# Altium schematic sheet integrator_inverter.SchDoc: Active Integrator
size A; Engineer: A. Peck; Organization: UCLA High Energy Physics; DocumentNumber: 13; Revision: 3.0; SheetNumber: 13; SheetTotal: 15; Project: LCT Comparator Tester
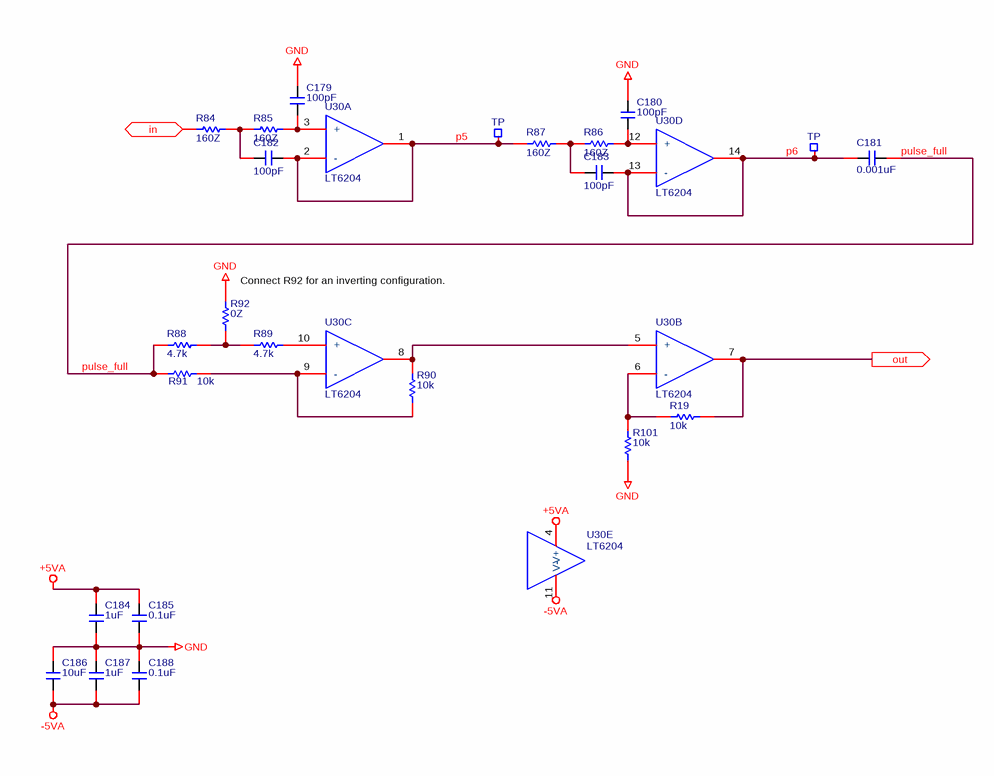
[diagram p0: integrator_inverter.SchDoc]

## Parts
C179  100pF  [C0603]
C180  100pF  [C0603]
C181  0.001uF  [C0603]
C182  100pF  [C0603]
C183  100pF  [C0603]
C184  1uF  [C0603]
C185  0.1uF  [C0603]
C186  10uF  [c1206]
C187  1uF  [C0603]
C188  0.1uF  [C0603]
R19  10k  [R0603]
R84  160Z  [R0603]
R85  160Z  [R0603]
R86  160Z  [R0603]
R87  160Z  [R0603]
R88  4.7k  [R0603]
R89  4.7k  [R0603]
R90  10k  [R0603]
R91  10k  [R0603]
R92  0Z  [R0603]
R101  10k  [R0603]
TP36  TP  [TP_MICRO]  (no BOM)
TP37  TP  [TP_MICRO]  (no BOM)
U30  LT6204  [SOIC-14]  (parts A,B,C,D,E of 5)

## Ports
in (in), out (out)

## Nets
+5VA: C184.2 C185.2 U30.4(V+)
-5VA: C186.1 C187.1 C188.1 U30.11(V-)
GND: C179.2 C180.2 C184.1 C185.1 C186.2 C187.2 C188.2 R92.1 R101.2
in: R84.1 ; port in
out: R19.2 U30.7(OUT) ; port out
p5: C182.2 R87.1 TP36.1 U30.1(OUT) U30.2(-)
p6: C181.2 C183.2 TP37.1 U30.13(-) U30.14(OUT)
pulse_full: C181.1 R88.1 R91.1
NetC179_1: C179.1 R85.2 U30.3(+)
NetC180_1: C180.1 R86.2 U30.12(+)
NetC182_1: C182.1 R84.2 R85.1
NetC183_1: C183.1 R86.1 R87.2
NetR19_1: R19.1 R101.1 U30.6(-)
NetR88_2: R88.2 R89.1 R92.2
NetR89_2: R89.2 U30.10(+)
NetR90_1: R90.1 U30.5(+) U30.8(OUT)
NetR90_2: R90.2 R91.2 U30.9(-)

## Notes on the sheet
- (near R92) Connect R92 for an inverting configuration.
- Date:
- Rev:
- of
- Sheet

## Library data of the parts
C179 C180 C182 C183 = AVX/06035A101KAT2A: CAP-CER, 0, 100pF, 10%, 50V, 0603; Manufacturer: AVX Corporation; Temperature Coefficient: C0G, NP0; Supplier 1: Digi-Key; Supplier Part Number 1: 478-3717-1-ND; Manufacturer Part Number: 06035A101KAT2A; RoHS: RoHS Compliant; Category: Capacitors; Stock 1: 55355; Pricing 1: 1=0.16, 10=0.117, 25=0.0856, 50=0.0664, 100=0.0551, 250=0.04556, 500=0.03862, 1000=0.03197 (USD); Packaging: Cut Tape (CT); Part Status: Active; Capacitance: 100pF; Tolerance: ±10%; Voltage - Rated: 50V; Operating Temperature: -55°C ~ 125°C; Features: -; Ratings: -; Applications: General Purpose; Failure Rate: *; Mounting Type: Surface Mount, MLCC; Package / Case: 0603 (1608 Metric); Size / Dimension: 0.063" L x 0.032" W (1.60mm x 0.81mm); Height - Seated (Max): -; Thickness (Max): 0.035" (0.90mm); Lead Spacing: -; Lead Style: -; ComponentLink1URL: http://catalogs.avx.com/SurfaceMount.pdf; ComponentLink1Description: http://catalogs.avx.com/SurfaceMount.pdf
C181 = CAP/GRM188R71H102KA01D: CAP-CER, 0, 1000pF, 10%, 50V, 0603; Manufacturer: Murata Electronics North America; Temperature Coefficient: X7R; Supplier 1: Digi-Key; Supplier Part Number 1: 490-1494-6-ND; Manufacturer Part Number: GRM188R71H102KA01D; RoHS: RoHS Compliant; Category: Capacitors; Stock 1: 1044569; Pricing 1: 1=0.1, 10=0.02, 50=0.0108, 100=0.0091, 250=0.00744, 500=0.00636, 1000=0.00495 (USD); Packaging: Digi-Reel®; Capacitance: 1000pF; Tolerance: ±10%; Voltage - Rated: 50V; Mounting Type: Surface Mount, MLCC; Operating Temperature: -55°C ~ 125°C; Applications: General Purpose; Ratings: -; Package / Case: 0603 (1608 Metric); Size / Dimension: 0.063" L x 0.031" W (1.60mm x 0.80mm); Height - Seated (Max): -; Thickness (Max): 0.035" (0.90mm); Lead Spacing: -; Features: -; Lead Style: -; ComponentLink1URL: http://www.murata.com/~/media/webrenewal/support/library/catalog/products/capacitor/mlcc/c02e.pdf; ComponentLink1Description: http://www.murata.com/~/media/webrenewal/support/library/catalog/products/capacitor/mlcc/c02e.pdf; Supplier 2: Newark; Supplier Part Number 2: 51B220
C184 C187 = Murata/GRM188R61E105KA12D: CAP-CER, 2, 1.0uF, 10%, 25V, 0603; Manufacturer: Murata Electronics North America; Capacitance: 1µF; Temperature Coefficient: X5R; Supplier 1: Digi-Key; Supplier Part Number 1: 490-3897-1-ND; Manufacturer Part Number: GRM188R61E105KA12D; RoHS: RoHS Compliant; Category: Capacitors; Stock 1: 1899119; Pricing 1: 1=0.1, 10=0.036, 50=0.0196, 100=0.0165, 250=0.01352, 500=0.01156, 1000=0.009 (USD); Packaging: Cut Tape (CT); Tolerance: ±10%; Voltage - Rated: 25V; Mounting Type: Surface Mount, MLCC; Operating Temperature: -55°C ~ 85°C; Applications: General Purpose; Ratings: -; Package / Case: 0603 (1608 Metric); Size / Dimension: 0.063" L x 0.031" W (1.60mm x 0.80mm); Height - Seated (Max): -; Thickness (Max): 0.035" (0.90mm); Lead Spacing: -; Features: -; Lead Style: -; ComponentLink1URL: http://www.murata.com/~/media/webrenewal/support/library/catalog/products/capacitor/mlcc/c02e.pdf; ComponentLink1Description: http://www.murata.com/~/media/webrenewal/support/library/catalog/products/capacitor/mlcc/c02e.pdf
C185 C188 = CAP/06035C104KAT2A: CAP-CER, 2, 0.1uF, 10%, 50V, 0603, X7R; Manufacturer: AVX Corporation; Capacitance: 0.10µF; Supplier 1: Digi-Key; Manufacturer Part Number: 06035C104KAT2A; RoHS: RoHS Compliant; Category: Capacitors; Stock 1: 4412408; Pricing 1: 1=0.1, 10=0.036, 25=0.0264, 50=0.0198, 100=0.0162, 250=0.01352, 500=0.01156, 1000=0.00908 (USD); Packaging: Cut Tape (CT); Tolerance: ±10%; Voltage - Rated: 50V; Temperature Coefficient: X7R; Mounting Type: Surface Mount, MLCC; Operating Temperature: -55°C ~ 125°C; Applications: General Purpose; Ratings: -; Package / Case: 0603 (1608 Metric); Size / Dimension: 0.063" L x 0.032" W (1.60mm x 0.81mm); Height - Seated (Max): -; Thickness (Max): 0.035" (0.90mm); Lead Spacing: -; Features: -; Lead Style: -; ComponentLink1URL: http://datasheets.avx.com/X7RDielectric.pdf; ComponentLink1Description: http://datasheets.avx.com/X7RDielectric.pdf; Supplier Part Number 1: 478-5052-1-ND; Supplier 2: Newark; Supplier Part Number 2: 54K2412
C186 = CAP/GMK316F106ZL-T: CAP-CER, 2, 10uF, 10%, 35V, 1206; Manufacturer: Taiyo Yuden; Capacitance: 10µF; Tolerance: -20%, +80%; Temperature Coefficient: Y5V (F); Supplier 1: Digi-Key; Manufacturer Part Number: GMK316F106ZL-T; RoHS: RoHS Compliant; Category: Capacitors; Packaging: Cut Tape (CT); Voltage - Rated: 35V; Mounting Type: Surface Mount, MLCC; Operating Temperature: -30°C ~ 85°C; Package / Case: 1206 (3216 Metric); Size / Dimension: 0.126" L x 0.063" W (3.20mm x 1.60mm); Height - Seated (Max): -; Lead Spacing: -; Features: -; ComponentLink1URL: http://ds.yuden.co.jp/TYCOMPAS/ut/detail.do?productNo=GMK316F106ZL-T&fileName=GMK316F106ZL-T_SS&mode=specSheetDownload; ComponentLink1Description: http://ds.yuden.co.jp/TYCOMPAS/ut/detail.do?productNo=GMK316F106ZL-T&fileName=GMK316F106ZL-T_SS&mode=specSheetDownload; Supplier Part Number 1: 587-1352-1-ND; Stock 1: 249989; Pricing 1: 1=0.46, 10=0.345, 50=0.2012, 100=0.161, 250=0.115, 500=0.0782, 1000=0.06325 (USD); Applications: General Purpose; Ratings: -; Thickness (Max): 0.071" (1.80mm); Lead Style: -
R19 R90 R91 R101 = CRCW060310K0FKEA: RES1, SMD, 10.0k, 1.0%, 1/10W, 0603; Manufacturer: Vishay Dale; Tolerance: ±1%; Power (Watts): 0.1W, 1/10W; Temperature Coefficient: ±100ppm/°C; Supplier 1: Digi-Key; Manufacturer Part Number: CRCW060310K0FKEA; RoHS: RoHS Compliant; Category: Resistors; Stock 1: 1592879; Pricing 1: 1=0.1, 10=0.03, 25=0.022, 50=0.0168, 100=0.0123, 250=0.0094, 500=0.00752, 1000=0.00554, 2500=0.00481 (USD); Packaging: Cut Tape (CT); Resistance (Ohms): 10k; Composition: Thick Film; Features: Automotive AEC-Q200; Operating Temperature: -55°C ~ 155°C; Package / Case: 0603 (1608 Metric); Supplier Device Package: 0603; Size / Dimension: 0.061" L x 0.033" W (1.55mm x 0.85mm); Height: 0.020" (0.50mm); Number of Terminations: 2; ComponentLink1URL: http://www.vishay.com/docs/20035/dcrcwe3.pdf; ComponentLink1Description: http://www.vishay.com/docs/20035/dcrcwe3.pdf; Supplier Part Number 1: 541-10.0KHCT-ND
R84-R87 = CRCW0603160RFKEA: RES0, SMD,  160Z, 1.0%, 1/10W, 0603; Manufacturer: Vishay Dale; Resistance (Ohms): 160; Tolerance: ±1%; Power (Watts): 0.1W, 1/10W; Temperature Coefficient: ±100ppm/°C; Supplier 1: Digi-Key; Manufacturer Part Number: CRCW0603160RFKEA; RoHS: RoHS Compliant; Category: Resistors; Stock 1: 48671; Pricing 1: 1=0.1, 10=0.03, 25=0.022, 50=0.0168, 100=0.0123, 250=0.0094, 500=0.00752, 1000=0.00554, 2500=0.00481 (USD); Packaging: Cut Tape (CT); Part Status: Active; Composition: Thick Film; Features: Automotive AEC-Q200; Operating Temperature: -55°C ~ 155°C; Package / Case: 0603 (1608 Metric); Supplier Device Package: 0603; Size / Dimension: 0.063" L x 0.033" W (1.60mm x 0.85mm); Height - Seated (Max): 0.020" (0.50mm); Number of Terminations: 2; Failure Rate: -; ComponentLink1URL: http://www.vishay.com/docs/20035/dcrcwe3.pdf; ComponentLink1Description: http://www.vishay.com/docs/20035/dcrcwe3.pdf; Supplier Part Number 1: 541-160HCT-ND
R88 R89 = CRCW06034K70FKEA: RES1, SMD, 4.70k, 1.0%, 1/10W, 0603; Manufacturer: Vishay Dale; Tolerance: ±1%; Power (Watts): 0.1W, 1/10W; Temperature Coefficient: ±100ppm/°C; Supplier 1: Digi-Key; Supplier Part Number 1: 541-4.70KHCT-ND; Manufacturer Part Number: CRCW06034K70FKEA; RoHS: RoHS Compliant; Category: Resistors; Packaging: Cut Tape (CT); Part Status: Active; Resistance (Ohms): 4.7k; Composition: Thick Film; Features: Automotive AEC-Q200; Operating Temperature: -55°C ~ 155°C; Package / Case: 0603 (1608 Metric); Supplier Device Package: 0603; Size / Dimension: 0.063" L x 0.033" W (1.60mm x 0.85mm); Height - Seated (Max): 0.020" (0.50mm); Number of Terminations: 2; Failure Rate: -; ComponentLink1URL: http://www.vishay.com/docs/20035/dcrcwe3.pdf; ComponentLink1Description: http://www.vishay.com/docs/20035/dcrcwe3.pdf; Stock 1: 413202; Pricing 1: 1=0.1, 10=0.03, 25=0.022, 50=0.0168, 100=0.0123, 250=0.0094, 500=0.00752, 1000=0.00554, 2500=0.00481 (USD)
R92 = CRCW06030000Z0EA: RES0, SMD, 0.00Z, 0603; Manufacturer: Vishay Dale; Resistance (Ohms): 0.0; Tolerance: Jumper; Power (Watts): 0.1W, 1/10W; Supplier 1: Digi-Key; Manufacturer Part Number: CRCW06030000Z0EA; RoHS: RoHS Compliant; Category: Resistors; Stock 1: 3403646; Pricing 1: 1=0.1, 10=0.022, 25=0.016, 50=0.0124, 100=0.0091, 250=0.00692, 500=0.00554, 1000=0.00408, 2500=0.00354 (USD); Packaging: Cut Tape (CT); Composition: Thick Film; Features: Automotive AEC-Q200; Temperature Coefficient: -; Operating Temperature: -55°C ~ 155°C; Package / Case: 0603 (1608 Metric); Supplier Device Package: 0603; Size / Dimension: 0.061" L x 0.033" W (1.55mm x 0.85mm); Height: 0.020" (0.50mm); Number of Terminations: 2; ComponentLink1URL: http://www.vishay.com/docs/20035/dcrcwe3.pdf; ComponentLink1Description: http://www.vishay.com/docs/20035/dcrcwe3.pdf; Supplier Part Number 1: 541-0.0GCT-ND; Supplier 2: Newark; Supplier Part Number 2: 52K8014
TP36 TP37 = TP_MICRO: Test Point, Round, Small
U30 = LT6204 SOIC-14: OPA, 100MHz, Quad, RRIO, Unity Stable; Supplier 1: Digi-Key; Supplier Part Number 1: LT6204CS#PBF-ND